# EAGLE design Water Level Sensor (EAGLE 9.6.2)
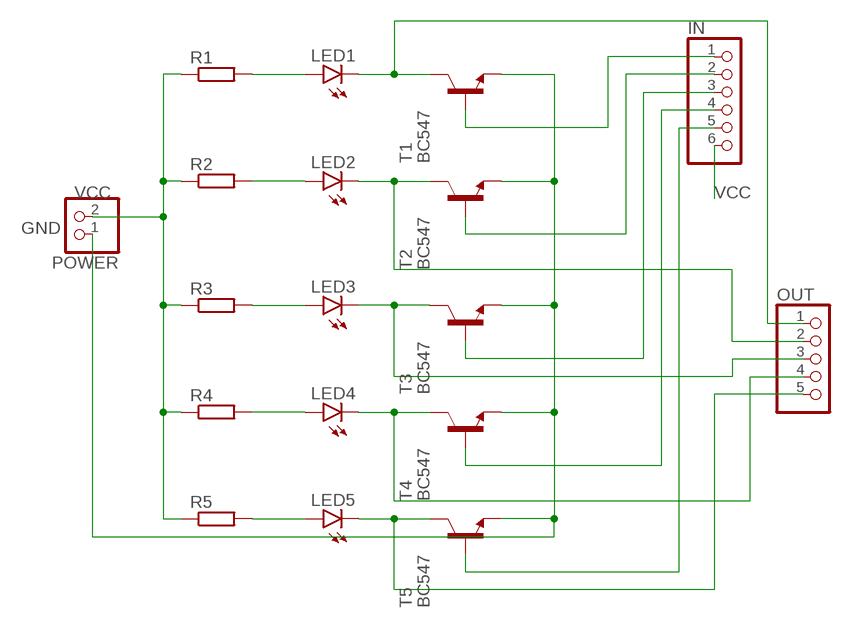
[diagram p0: schematic, sheet 1]

## Parts
IN  PINHD-1X6  [1X06]
LED1  LED5MM  [LED5MM]
LED2  LED5MM  [LED5MM]
LED3  LED5MM  [LED5MM]
LED4  LED5MM  [LED5MM]
LED5  LED5MM  [LED5MM]
OUT  PINHD-1X5  [1X05]
POWER  PINHD-1X2  [1X02]
R1  R-EU_0204/7  [0204/7]
R2  R-EU_0204/7  [0204/7]
R3  R-EU_0204/7  [0204/7]
R4  R-EU_0204/7  [0204/7]
R5  R-EU_0204/7  [0204/7]
T1  BC547  [TO92]
T2  BC547  [TO92]
T3  BC547  [TO92]
T4  BC547  [TO92]
T5  BC547  [TO92]

## Nets
GND: POWER.1 T1.1(E) T2.1(E) T3.1(E) T4.1(E) T5.1(E)
N$1: LED1.K(C) OUT.1 T1.3(C)
N$2: LED2.K(C) OUT.2 T2.3(C)
N$3: LED3.K(C) OUT.3 T3.3(C)
N$4: LED4.K(C) OUT.4 T4.3(C)
N$6: LED1.A R1.2
N$7: LED2.A R2.2
N$8: LED3.A R3.2
N$9: LED4.A R4.2
N$10: LED5.A R5.2
N$13: IN.1 T1.2(B)
N$14: IN.2 T2.2(B)
N$15: IN.3 T3.2(B)
N$16: IN.4 T4.2(B)
N$17: IN.5 T5.2(B)
N$19: LED5.K(C) OUT.5 T5.3(C)
VCC: IN.6 POWER.2 R1.1 R2.1 R3.1 R4.1 R5.1

## Library data of the parts
IN = pinhead:PINHD-1X6: PIN HEADER
LED1-LED5 = led:LED: LED OSRAM: - CHIPLED LG R971, LG N971, LY N971, LG Q971, LY Q971, LO R971, LY R971 LH N974, LH R974 LS Q976, LO Q976, LY Q976 LO Q996 - Hyper CHIPLED LW Q18S LB Q993, LB Q99A, LB R99A - SideLED LS A670, LO A670, LY A670, LG A670, LP A670 LB A673, LV A673, LT A673, LW A673 LH A674 LY A675 LS A676, LA A676, LO A676, LY A676, LW A676 LS A679, LY A679, LG A679 - Hyper Micro SIDELED® LS Y876, LA Y876, LO Y876, LY Y876 LT Y87S - SmartLED LW L88C, LW L88S LB L89C, LB L89S, LG L890 LS L89K, LO L89K, LY L89K LS L896, LA L896, LO L896, LY L896 - TOPLED LS T670, LO T670, LY T670, LG T670, LP T670 LSG T670, LSP T670, LSY T670, LOP T670, LYG T670 LG T671, LOG T671, LSG T671 LB T673, LV T673, LT T673, LW T673 LH T674 LS T676, LA T676, LO T676, LY T676, LB T676, LH T676, LSB T676, LW T676 LB T67C, LV T67C, LT T67C, LS T67K, LO T67K, LY T67K, LW E67C LS E67B, LA E67B, LO E67B, LY E67B, LB E67C, LV E67C, LT E67C LW T67C LS T679, LY T679, LG T679 LS T770, LO T770, LY T770, LG T770, LP T770 LB T773, LV T773, LT T773, LW T773 LH T774 LS E675, LA E675, LY E675, LS T675 LS T776, LA T776, LO T776, LY T776, LB T776 LHGB T686 LT T68C, LB T68C - Hyper Mini TOPLED® LB M676 - Mini TOPLED Santana® LG M470 LS M47K, LO M47K, LY M47K Source: http://www.osram.convergy.de LUXEON: - LUMILED® LXK2-PW12-R00, LXK2-PW12-S00, LXK2-PW14-U00, LXK2-PW14-V00 LXK2-PM12-R00, LXK2-PM12-S00, LXK2-PM14-U00 LXK2-PE12-Q00, LXK2-PE12-R00, LXK2-PE12-S00, LXK2-PE14-T00, LXK2-PE14-U00 LXK2-PB12-K00, LXK2-PB12-L00, LXK2-PB12-M00, LXK2-PB14-N00, LXK2-PB14-P00, LXK2-PB14-Q00 LXK2-PR12-L00, LXK2-PR12-M00, LXK2-PR14-Q00, LXK2-PR14-R00 LXK2-PD12-Q00, LXK2-PD12-R00, LXK2-PD12-S00 LXK2-PH12-R00, LXK2-PH12-S00 LXK2-PL12-P00, LXK2-PL12-Q00, LXK2-PL12-R00 Source: www.luxeon.com KINGBRIGHT: KA-3528ASYC Source: www.kingbright.com
OUT = pinhead:PINHD-1X5: PIN HEADER
POWER = pinhead:PINHD-1X2: PIN HEADER
R1-R5 = rcl:R-EU_: RESISTOR, European symbol; SPICEPREFIX: R
T1-T5 = transistor:BC547: NPN TRANSISTOR

## Board
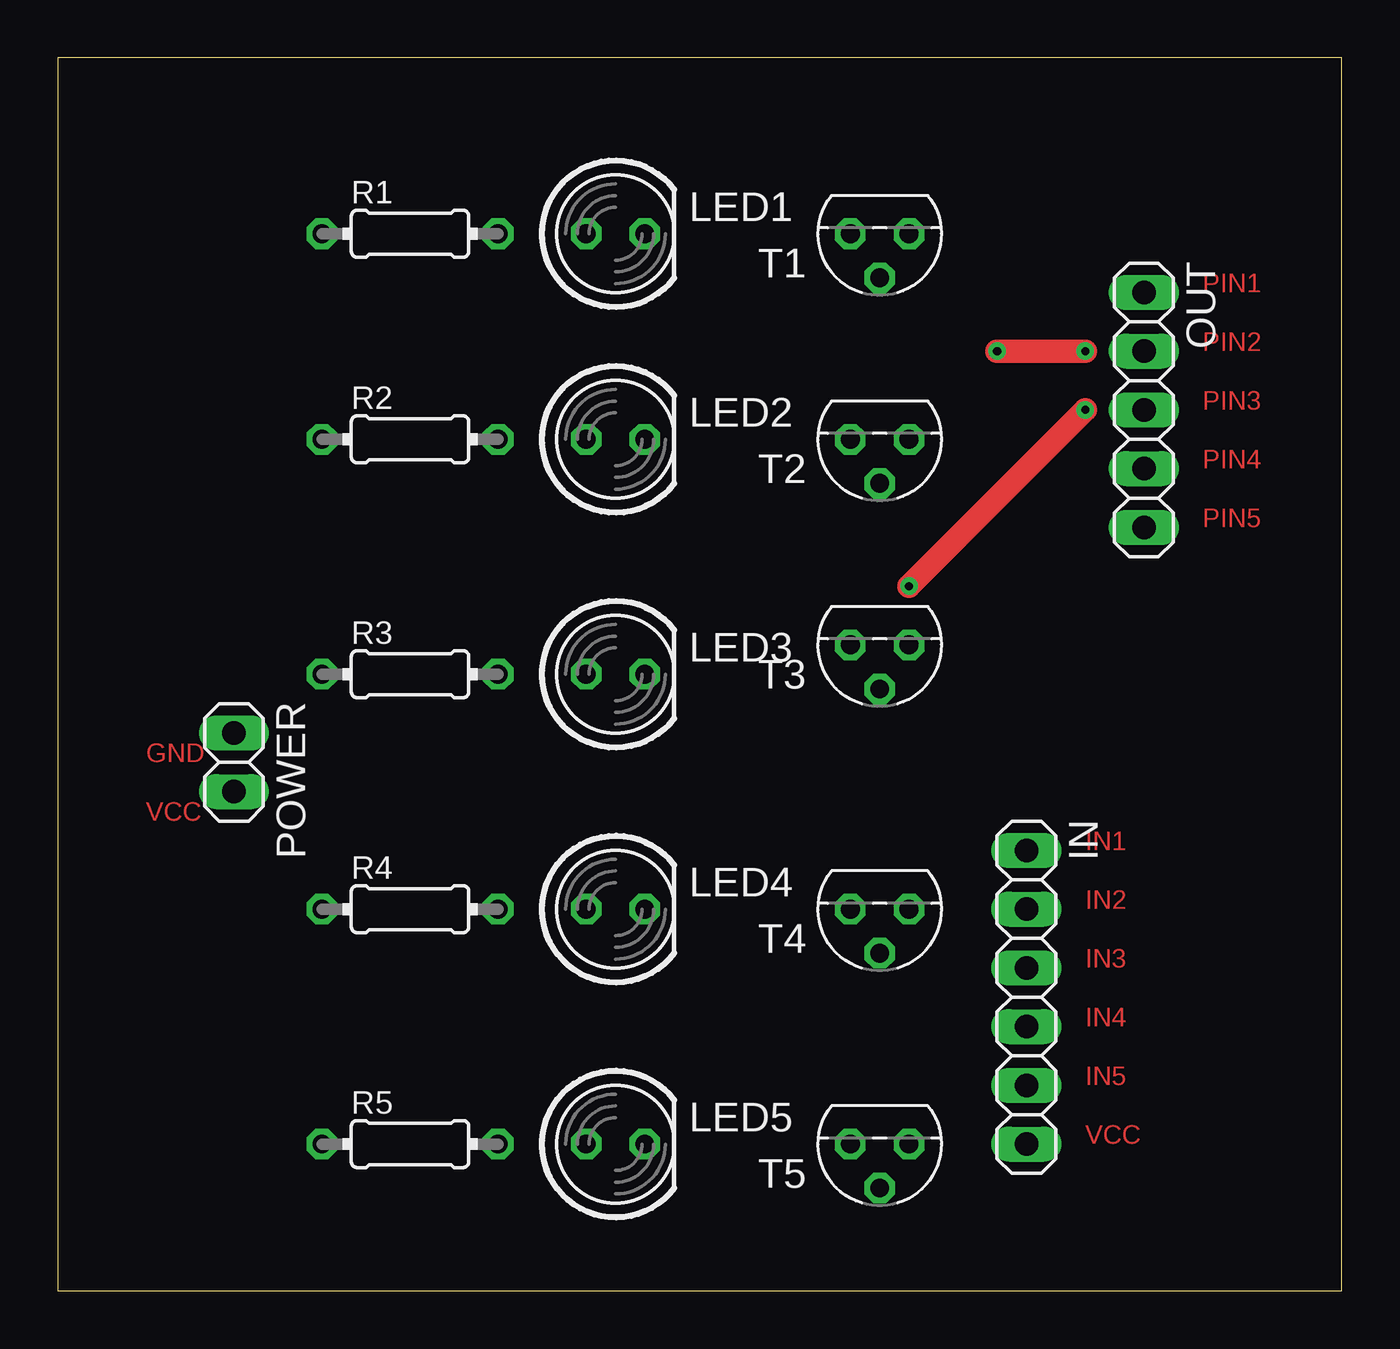
[diagram p1: board, top side]
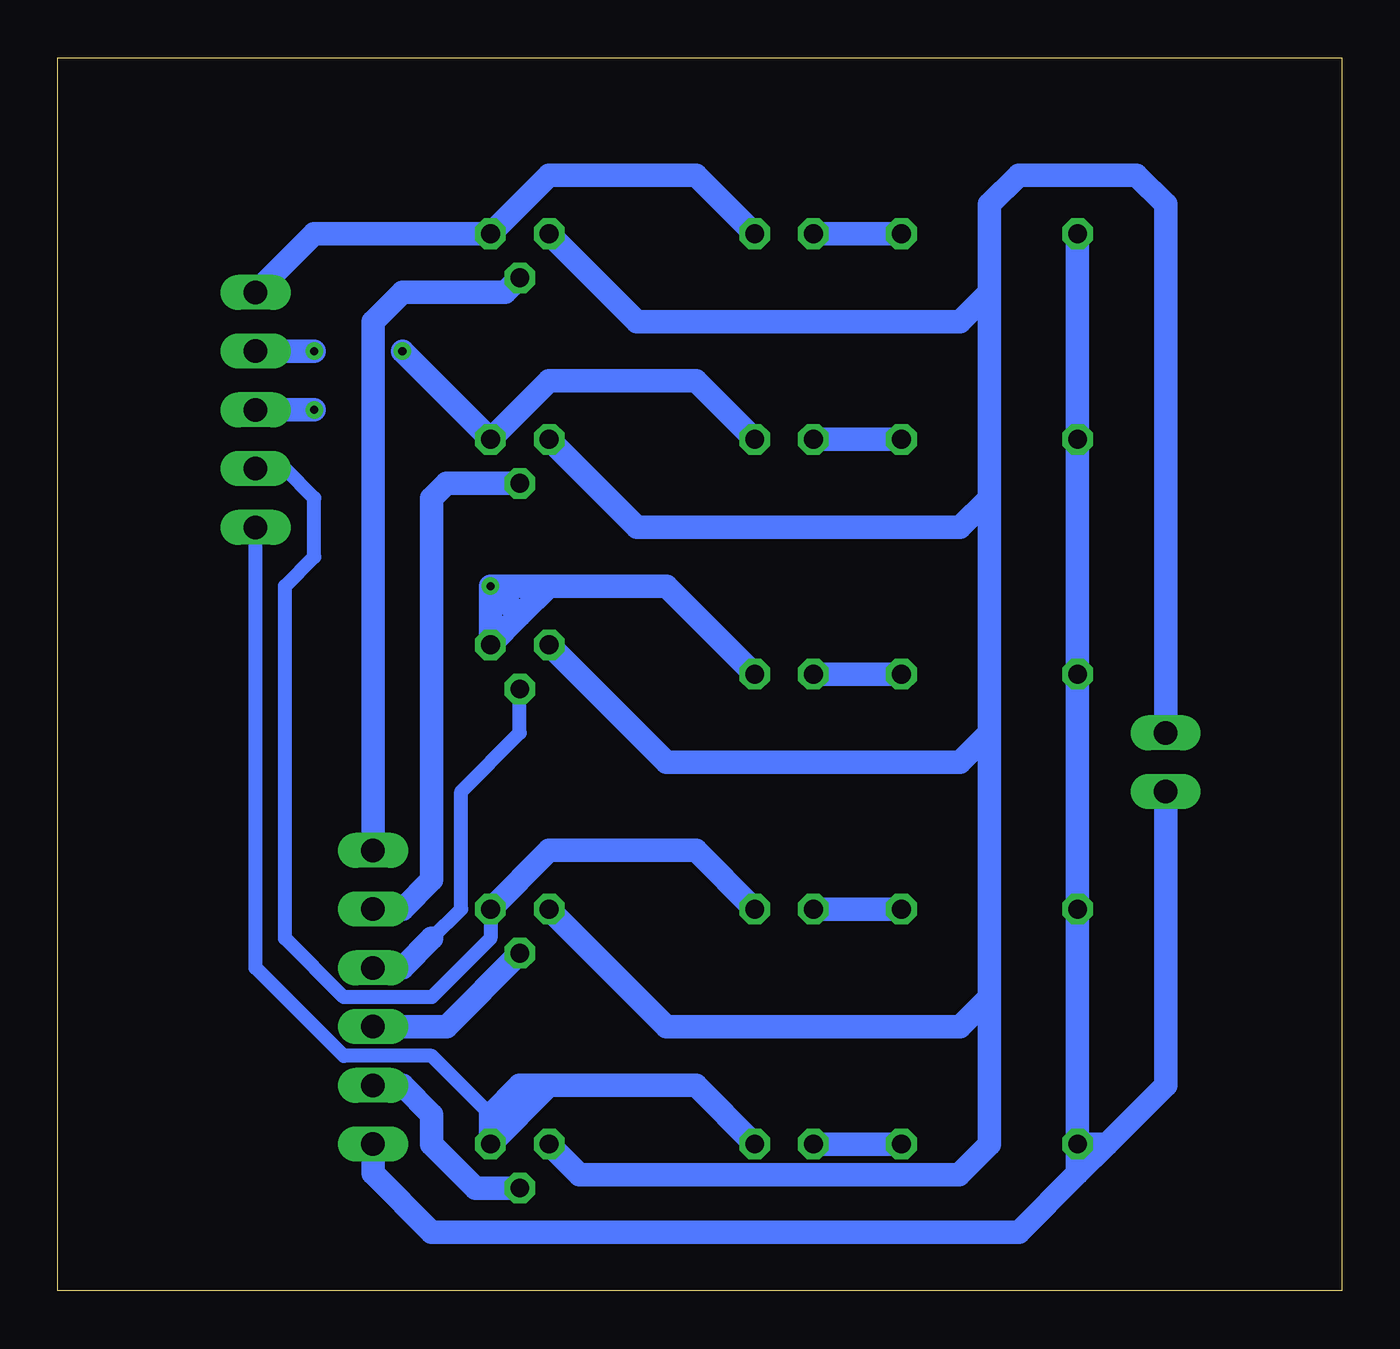
[diagram p2: board, bottom side, seen from below]

Size 55.55 x 53.33 mm. Coordinates in mm from the lower left corner, seen from the top.
Outline: 0,0 55.55,0 55.55,53.33 0,53.33 0,0
Copper layers (1*16): Top 0.035mm / dielectric 1.5mm / Bottom 0.035mm
Design rules "default": minimum track width 6mil, minimum drill 0.35mm, track to track 6mil, track to pad 6mil, pad to pad 6mil, via to via 6mil, smd to smd 6mil, copper to edge 40mil, drill to drill 6mil, minimum pad ring 10mil, minimum via ring 8mil, stop-mask expansion 4mil, vias tented up to drill 0mil, thermal gap 10mil

### Footprints (pad centres in the part's own frame; a part is rotated, then mirrored left to right if it is on the bottom)
1X06 = drill 1.016 long: 1 -6.35,0; 2 -3.81,0; 3 -1.27,0; 4 1.27,0; 5 3.81,0; 6 6.35,0
LED5MM = drill 0.813 octagon: A -1.27,0; K 1.27,0
1X05 = drill 1.016 long: 1 -5.08,0; 2 -2.54,0; 3 0,0; 4 2.54,0; 5 5.08,0
1X02 = drill 1.016 long: 1 -1.27,0; 2 1.27,0
0204/7 = drill 0.813 octagon: 1 -3.81,0; 2 3.81,0
TO92 = drill 0.813 octagon: 1 1.27,0; 2 0,1.905; 3 -1.27,0

### Placement (x,y rotation side)
IN  41.91,12.7 270 top
LED1  24.13,45.72 0 top
LED2  24.13,36.83 0 top
LED3  24.13,26.67 0 top
LED4  24.13,16.51 0 top
LED5  24.13,6.35 0 top
OUT  46.99,38.1 270 top
POWER  7.62,22.86 270 top
R1  15.24,45.72 0 top
R2  15.24,36.83 0 top
R3  15.24,26.67 0 top
R4  15.24,16.51 0 top
R5  15.24,6.35 0 top
T1  35.56,45.72 180 top
T2  35.56,36.83 180 top
T3  35.56,27.94 180 top
T4  35.56,16.51 180 top
T5  35.56,6.35 180 top

### Tracks (layer width: path | path; a pad name or v marks a point on that pad's centre or on a via)
GND
  Bottom 1.016: POWER.1 7.62,46.99 8.89,48.26 13.97,48.26 15.24,46.99 15.24,43.18 | 15.24,43.18 16.51,41.91 30.48,41.91 T1.1 | 15.24,43.18 15.24,34.29 | 15.24,34.29 16.51,33.02 30.48,33.02 T2.1 | 15.24,34.29 15.24,24.13 | 15.24,24.13 16.51,22.86 29.21,22.86 T3.1 | 15.24,24.13 15.24,12.7 | 15.24,12.7 16.51,11.43 29.21,11.43 T4.1 | 15.24,12.7 15.24,6.35 16.56,5.03 32.97,5.03 T5.1
N$1
  Bottom 1.016: LED1.K 27.94,48.26 34.29,48.26 T1.3 44.45,45.72 OUT.1
N$2  (via drill 0.35)
  Top 1.016: v40.64,40.64 v44.45,40.64
  Bottom 1.016: LED2.K 27.94,39.37 34.29,39.37 T2.3 v40.64,40.64 | OUT.2 v44.45,40.64
N$3  (via drill 0.35)
  Top 1.016: v36.83,30.48 v44.45,38.1
  Bottom 1.016: LED3.K 29.21,30.48 34.29,30.48 | OUT.3 v44.45,38.1 | v36.83,30.48 T3.3 35.56,29.21 | v36.83,30.48 34.29,30.48 | 34.29,30.48 35.56,29.21 | 35.56,29.21 v36.83,30.48
N$4
  Bottom 0.61: T4.3 36.83,15.24 39.37,12.7 43.18,12.7 45.72,15.24 45.72,30.48 44.45,31.75 44.45,34.29 45.72,35.56 OUT.4
  Bottom 1.016: LED4.K 27.94,19.05 34.29,19.05 T4.3
N$6
  Bottom 1.016: R1.2 LED1.A
N$7
  Bottom 1.016: R2.2 LED2.A
N$8
  Bottom 1.016: R3.2 LED3.A
N$9
  Bottom 1.016: R4.2 LED4.A
N$10
  Bottom 1.016: R5.2 LED5.A
N$13
  Bottom 1.016: IN.1 41.91,41.91 40.64,43.18 36.2,43.18 T1.2
N$14
  Bottom 1.016: IN.2 40.64,16.51 39.37,17.78 39.37,34.29 38.73,34.92 T2.2
N$15
  Bottom 0.61: 39.37,15.24 38.1,16.51 38.1,21.59 35.56,24.13 T3.2
  Bottom 1.016: IN.3 40.64,13.97 39.37,15.24
N$16
  Bottom 1.016: T4.2 38.73,11.43 IN.4
N$17
  Bottom 1.016: IN.5 40.64,8.89 39.37,7.62 39.37,6.35 37.47,4.45 T5.2
N$19
  Bottom 0.61: 36.83,7.62 39.37,10.16 43.18,10.16 46.99,13.97 OUT.5
  Bottom 1.016: LED5.K 27.94,8.89 34.29,8.89 | 34.29,8.89 T5.3 36.83,7.62 35.56,8.89 34.29,8.89
VCC
  Bottom 1.016: 10.16,6.35 7.62,8.89 POWER.2 7.62,20.32 | 10.16,6.35 R5.1 | R1.1 R2.1 R3.1 R4.1 R5.1 | R5.1 11.43,5.08 | IN.6 41.91,5.08 39.37,2.54 13.97,2.54 11.43,5.08 | 10.16,6.35 11.43,5.08

### Text on the board
Top: PIN1 | PIN2 | PIN3 | PIN4 | PIN5 | GND | VCC | IN1 | IN2 | IN3 | IN4 | IN5 | VCC